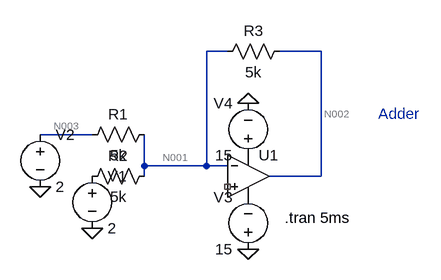
[diagram p0: schematic Adder.asc]
Adder.asc, the LTspice schematic file:
Version 4
SHEET 1 880 680
WIRE 160 -32 128 -32
WIRE 304 -32 240 -32
WIRE -48 96 -128 96
WIRE 32 144 32 96
WIRE 128 144 128 -32
WIRE 128 144 32 144
WIRE 160 144 128 144
WIRE 32 160 32 144
WIRE 304 160 304 -32
WIRE 304 160 224 160
FLAG 192 48 0
FLAG 192 272 0
FLAG -48 240 0
FLAG -128 176 0
SYMBOL Opamps\\UniversalOpamp2 192 160 R0
SYMATTR InstName U1
SYMBOL res 48 80 R90
WINDOW 0 0 56 VBottom 2
WINDOW 3 32 56 VTop 2
SYMATTR InstName R1
SYMATTR Value 5k
SYMBOL res 48 144 R90
WINDOW 0 0 56 VBottom 2
WINDOW 3 32 56 VTop 2
SYMATTR InstName R2
SYMATTR Value 5k
SYMBOL res 256 -48 R90
WINDOW 0 0 56 VBottom 2
WINDOW 3 32 56 VTop 2
SYMATTR InstName R3
SYMATTR Value 5k
SYMBOL voltage -48 144 R0
WINDOW 123 0 0 Left 0
WINDOW 39 0 0 Left 0
SYMATTR InstName V1
SYMATTR Value 2
SYMBOL voltage -128 80 R0
WINDOW 123 0 0 Left 0
WINDOW 39 0 0 Left 0
SYMATTR InstName V2
SYMATTR Value 2
SYMBOL voltage 192 288 R180
WINDOW 0 24 96 Left 2
WINDOW 3 24 16 Left 2
WINDOW 123 0 0 Left 0
WINDOW 39 0 0 Left 0
SYMATTR InstName V3
SYMATTR Value 15
SYMBOL voltage 192 144 R180
WINDOW 0 24 96 Left 2
WINDOW 3 24 16 Left 2
WINDOW 123 0 0 Left 0
WINDOW 39 0 0 Left 0
SYMATTR InstName V4
SYMATTR Value 15
TEXT 248 224 Left 2 !.tran 5ms
TEXT 392 64 Left 2 ;Adder

The netlist it stands for:
* Adder.asc
XU1 NC_01 N001 P001 P002 N002 level.2 Avol=1Meg GBW=10Meg Slew=10Meg ilimit=25m rail=0 Vos=0 phimargin=45 en=0 enk=0 in=0 ink=0 Rin=500Meg  ; pins IN+ IN- V+ V- OUT
R1 N001 N003 5k
R2 N001 P003 5k
R3 N002 N001 5k
V1 P003 0 2
V2 N003 0 2
V3 0 P002 15
V4 P001 0 15
.tran 5ms
* Adder
.lib UniversalOpamps2.sub
.backanno
.end

* Results of the author's LTspice run, read from the files saved beside the schematic
* Operating Point, zero values left out:
*   V(n002) = -4 V
*   V(p001) = 15 V
*   V(p002) = -15 V
*   V(n001) = 4.013 µV
*   V(n003) = 2 V
*   V(p003) = 2 V
*   I(R3) = -800 µA
*   I(R2) = -400 µA
*   I(R1) = -400 µA
*   I(V4) = -1.098 mA
*   I(V3) = -1.898 mA
*   I(V2) = -400 µA
*   I(V1) = -400 µA
*   Ix(u1:3) = 1.098 mA
*   Ix(u1:4) = -1.898 mA
*   Ix(u1:5) = 800 µA